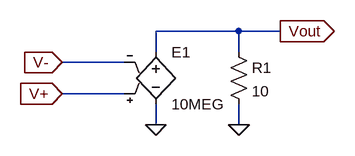
[diagram p0: schematic MY_IDEAL_opamp.asc]
MY_IDEAL_opamp.asc, the LTspice schematic file:
Version 4
SHEET 1 880 680
WIRE 272 48 144 48
WIRE 336 48 272 48
WIRE 144 80 144 48
WIRE 272 80 272 48
WIRE 96 96 0 96
WIRE 96 144 0 144
WIRE 144 192 144 160
WIRE 272 192 272 160
FLAG 0 96 V-
IOPIN 0 96 In
FLAG 0 144 V+
IOPIN 0 144 In
FLAG 336 48 Vout
IOPIN 336 48 Out
FLAG 144 192 0
FLAG 272 192 0
SYMBOL e2 144 64 R0
SYMATTR InstName E1
SYMATTR Value 10MEG
SYMBOL res 256 64 R0
SYMATTR InstName R1
SYMATTR Value 10

The netlist it stands for:
* MY_IDEAL_opamp.asc
E1 Vout 0 V+ V- 10MEG
R1 Vout 0 10
.backanno
.end